# Altium schematic sheet smartGarden_Sen_Rev01.SchDoc
size A
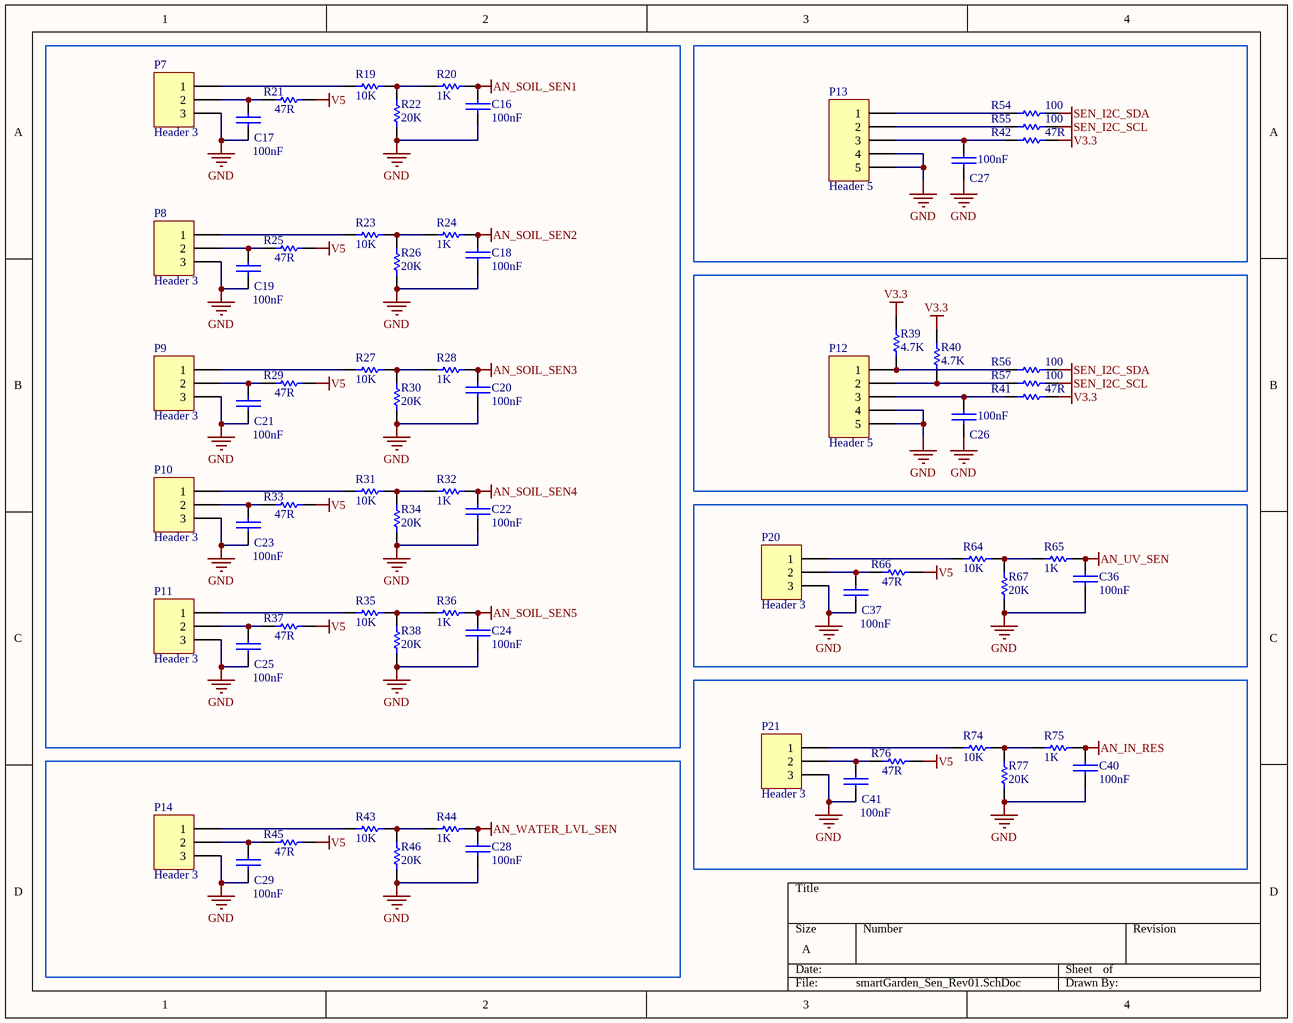
[diagram p0: smartGarden_Sen_Rev01.SchDoc]

## Parts
C16  100nF  [0805_smd]
C17  100nF  [0805_smd]
C18  100nF  [0805_smd]
C19  100nF  [0805_smd]
C20  100nF  [0805_smd]
C21  100nF  [0805_smd]
C22  100nF  [0805_smd]
C23  100nF  [0805_smd]
C24  100nF  [0805_smd]
C25  100nF  [0805_smd]
C26  100nF  [0805_smd]
C27  100nF  [0805_smd]
C28  100nF  [0805_smd]
C29  100nF  [0805_smd]
C36  100nF  [0805_smd]
C37  100nF  [0805_smd]
C40  100nF  [0805_smd]
C41  100nF  [0805_smd]
P7  Header 3  [HDR1X3]
P8  Header 3  [HDR1X3]
P9  Header 3  [HDR1X3]
P10  Header 3  [HDR1X3]
P11  Header 3  [HDR1X3]
P12  Header 5  [HDR1X5]
P13  Header 5  [HDR1X5]
P14  Header 3  [HDR1X3]
P20  Header 3  [HDR1X3]
P21  Header 3  [HDR1X3]
R19  10K  [0805_smd]
R20  1K  [0805_smd]
R21  47R  [0805_smd]
R22  20K  [0805_smd]
R23  10K  [0805_smd]
R24  1K  [0805_smd]
R25  47R  [0805_smd]
R26  20K  [0805_smd]
R27  10K  [0805_smd]
R28  1K  [0805_smd]
R29  47R  [0805_smd]
R30  20K  [0805_smd]
R31  10K  [0805_smd]
R32  1K  [0805_smd]
R33  47R  [0805_smd]
R34  20K  [0805_smd]
R35  10K  [0805_smd]
R36  1K  [0805_smd]
R37  47R  [0805_smd]
R38  20K  [0805_smd]
R39  4.7K  [0805_smd]
R40  4.7K  [0805_smd]
R41  47R  [0805_smd]
R42  47R  [0805_smd]
R43  10K  [0805_smd]
R44  1K  [0805_smd]
R45  47R  [0805_smd]
R46  20K  [0805_smd]
R54  100  [0805_smd]
R55  100  [0805_smd]
R56  100  [0805_smd]
R57  100  [0805_smd]
R64  10K  [0805_smd]
R65  1K  [0805_smd]
R66  47R  [0805_smd]
R67  20K  [0805_smd]
R74  10K  [0805_smd]
R75  1K  [0805_smd]
R76  47R  [0805_smd]
R77  20K  [0805_smd]

## Nets
AN_IN_RES: C40.2 R75.1
AN_SOIL_SEN1: C16.2 R20.1
AN_SOIL_SEN2: C18.2 R24.1
AN_SOIL_SEN3: C20.2 R28.1
AN_SOIL_SEN4: C22.2 R32.1
AN_SOIL_SEN5: C24.2 R36.1
AN_UV_SEN: C36.2 R65.1
AN_WATER_LVL_SEN: C28.2 R44.1
GND: C16.1 C17.1 C18.1 C19.1 C20.1 C21.1 C22.1 C23.1 C24.1 C25.1 C26.1 C27.1 C28.1 C29.1 C36.1 C37.1 C40.1 C41.1 P7.3 P8.3 P9.3 P10.3 P11.3 P12.4 P12.5 P13.4 P13.5 P14.3 P20.3 P21.3 R22.2 R26.2 R30.2 R34.2 R38.2 R46.2 R67.2 R77.2
SEN_I2C_SCL: R55.1 R57.1
SEN_I2C_SDA: R54.1 R56.1
V3.3: R39.1 R40.1 R41.1 R42.1
V5: R21.1 R25.1 R29.1 R33.1 R37.1 R45.1 R66.1 R76.1
NetC17_2: C17.2 P7.2 R21.2
NetC19_2: C19.2 P8.2 R25.2
NetC21_2: C21.2 P9.2 R29.2
NetC23_2: C23.2 P10.2 R33.2
NetC25_2: C25.2 P11.2 R37.2
NetC26_2: C26.2 P12.3 R41.2
NetC27_2: C27.2 P13.3 R42.2
NetC29_2: C29.2 P14.2 R45.2
NetC37_2: C37.2 P20.2 R66.2
NetC41_2: C41.2 P21.2 R76.2
NetP7_1: P7.1 R19.2
NetP8_1: P8.1 R23.2
NetP9_1: P9.1 R27.2
NetP10_1: P10.1 R31.2
NetP11_1: P11.1 R35.2
NetP12_1: P12.1 R39.2 R56.2
NetP12_2: P12.2 R40.2 R57.2
NetP13_1: P13.1 R54.2
NetP13_2: P13.2 R55.2
NetP14_1: P14.1 R43.2
NetP20_1: P20.1 R64.2
NetP21_1: P21.1 R74.2
NetR19_1: R19.1 R20.2 R22.1
NetR23_1: R23.1 R24.2 R26.1
NetR27_1: R27.1 R28.2 R30.1
NetR31_1: R31.1 R32.2 R34.1
NetR35_1: R35.1 R36.2 R38.1
NetR43_1: R43.1 R44.2 R46.1
NetR64_1: R64.1 R65.2 R67.1
NetR74_1: R74.1 R75.2 R77.1

## Library data of the parts
C16-C29 C36 C37 C40 C41 = CAP: Capacitor
P7-P11 P14 P20 P21 = Header 3: Header, 3-Pin; LatestRevisionDate: 17-Jul-2002; LatestRevisionNote: Re-released for DXP Platform.; Publisher: Altium Limited
P12 P13 = Header 5: Header, 5-Pin; LatestRevisionDate: 17-Jul-2002; LatestRevisionNote: Re-released for DXP Platform.; Publisher: Altium Limited
R19-R46 R54-R57 R64-R67 R74-R77 = Res1: Resistor; Published: 8-Jun-2000; LatestRevisionDate: 17-Jul-2002; LatestRevisionNote: Re-released for DXP Platform.; PackageReference: AXIAL-0.3; Publisher: Altium Limited